# Altium schematic sheet Regul.SchDoc
size A
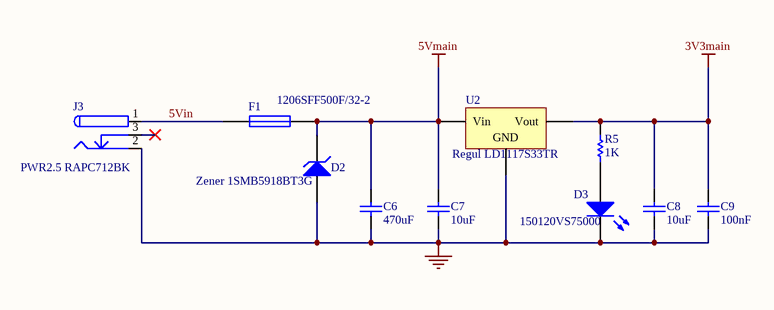
[diagram p0: Regul.SchDoc]

## Parts
C6  470uF  [CONDO_D_10mm]
C7  10uF  [CONDO_D_5MM]
C8  10uF  [CONDO_D_5MM]
C9  100nF  [1608 / 0603]
D2  Zener 1SMB5918BT3G  [DIODE ZENER]
D3  150120VS75000  [3216 / 1206]
F1  1206SFF500F/32-2  [3216 / 1206]
J3  PWR2.5 RAPC712BK  [RAPC712BK]
R5  1K  [1608 / 0603]
U2  Regul LD1117S33TR  [SOT-223]

## Nets
3V3main: C8.2 C9.2 R5.2 U2.3(Vout)
5Vmain: C6.2 C7.2 D2.2(K) F1.2 U2.1(Vin)
GND: C6.1 C7.1 C8.1 C9.1 D2.1(A) D3.2(K) J3.2 U2.2(GND)
5Vin: F1.1 J3.1
NetD3_1: D3.1(A) R5.1

Not connected (* = marked no-connect by the designer): J3 3*

## Library data of the parts
C6 = Cap: Capacitor; Value: ECA-1EHG471; fabricant: Panasonic; fournisseur: Farnell; reffournisseur: 9692843; Published: 8-Jun-2000; LatestRevisionDate: 17-Jul-2002; LatestRevisionNote: Re-released for DXP Platform.; PackageReference: RAD-0.3; Publisher: Altium Limited; PackageDescription: Radial Cap, Thru-Hole; 2 Leads; 0.3 in Pin Spacing
C7 C8 = Cap: Capacitor; Value: 100pF; fabricant: Panasonic; fournisseur: Farnell; reffabricant: ECA-1JHG100; reffournisseur: 1848557; Published: 8-Jun-2000; LatestRevisionDate: 17-Jul-2002; LatestRevisionNote: Re-released for DXP Platform.; PackageReference: RAD-0.3; Publisher: Altium Limited; PackageDescription: Radial Cap, Thru-Hole; 2 Leads; 0.3 in Pin Spacing
C9 = Cap: Capacitor; Published: 8-Jun-2000; LatestRevisionDate: 17-Jul-2002; LatestRevisionNote: Re-released for DXP Platform.; PackageReference: RAD-0.3; Publisher: Altium Limited; PackageDescription: Radial Cap, Thru-Hole; 2 Leads; 0.3 in Pin Spacing; Value: 100nF
D2 = D Zener: Zener Diode; fournisseur: Farnell; reffournisseur: 1431161; fabricant: ON SEMICONDUCTORS; Published: 8-Jun-2000; LatestRevisionDate: 17-Jul-2002; LatestRevisionNote: Re-released for DXP Platform.; PackageReference: DIODE-0.7; Publisher: Altium Limited; PackageDescription: Diode, Thru-Hole; 2 Leads; 0.7 in Pin Spacing; reffabricant: 1SMB5918BT3G
D3 = LED0: Green LED; fournisseur: Farnell; reffournisseur: 2322088; fabricant: WURTH ELEKTRONIK; Published: 8-Jun-2000; LatestRevisionDate: 08-Jul-2005; LatestRevisionNote: Mech Layer 1 removed.; PackageReference: LED-0; Publisher: Altium Limited; PackageDescription: LED; 2 Leads; reffabricant: 150120VS75000
F1 = Fuse 1: Fuse; fournisseur: Farnell; reffournisseur: 1843811; fabricant: TE CONNECTIVITY / RAYCHEM; Published: 8-Jun-2000; LatestRevisionDate: 17-Jul-2002; LatestRevisionNote: Re-released for DXP Platform.; PackageReference: PIN-W2/E2.8; Publisher: Altium Limited; PackageDescription: Thru-Hole; 2 Leads; reffabricant: 1206SFF500F/32-2
J3 = PWR2.5: Jack Connector; fournisseur: Farnell; reffournisseur: 1617204; fabricant: SWITCHCRAFT; Published: 17-Dec-2003; DatasheetDocument: 09-May-2002; Publisher: Altium Limited; ComponentLink1Description: Manufacturer Link; ComponentLink1URL: http://domino.kycon.com/internet/Products.html; reffabricant: RAPC712BK
R5 = Res1: Resistor; Published: 8-Jun-2000; LatestRevisionDate: 17-Jul-2002; LatestRevisionNote: Re-released for DXP Platform.; PackageReference: AXIAL-0.3; Publisher: Altium Limited; PackageDescription: Axial Device, Thru-Hole; 2 Leads; 0.3 in Pin Spacing; Value: 1K
U2 = Volt Reg: Voltage Regulator; fournisseur: Farnell; reffournisseur: 1202826; fabricant: ST MICRO; Published: 24-Mar-1999; LatestRevisionDate: 29-May-2009; LatestRevisionNote: IPC-7351 Footprint Added.; PackageReference: D2PAK; Publisher: Altium Limited; PackageDescription: 3-Pin Transistor Outline Package 2.54 mm Pitch, 15.1 mm Lead Span; reffabricant: LD1117S33TR